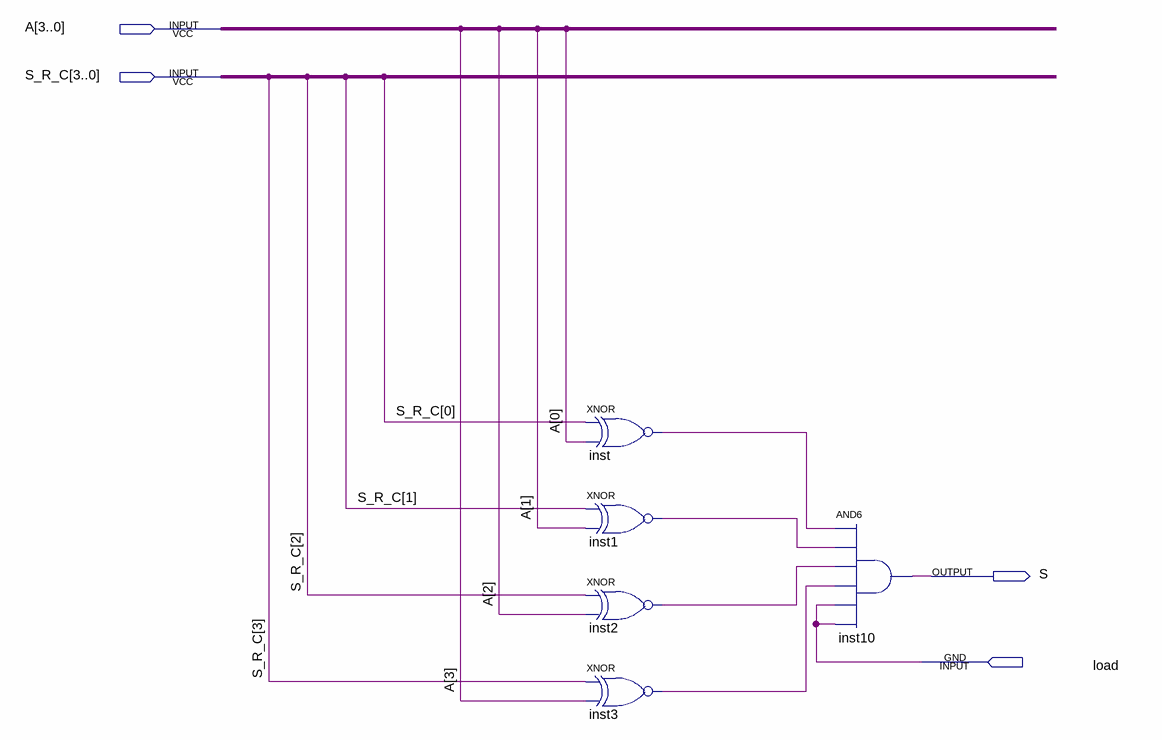
[diagram p0: schematic sheet]
// Quartus schematic comparador.bdf as structural Verilog: 5 symbols, 4 pins
module comparador (
  input  [3:0] A,
  input  [3:0] S_R_C,
  input  load,
  output S
);

  wire inst1_out, inst2_out, inst3_out, inst_out;

  xnor inst (inst_out, S_R_C[0], A[0]);
  xnor inst1 (inst1_out, S_R_C[1], A[1]);
  xnor inst2 (inst2_out, S_R_C[2], A[2]);
  xnor inst3 (inst3_out, S_R_C[3], A[3]);
  and inst10 (S, inst_out, inst1_out, inst2_out, inst3_out, load, load);
endmodule
